# EAGLE design bbot (EAGLE 9.6.2)
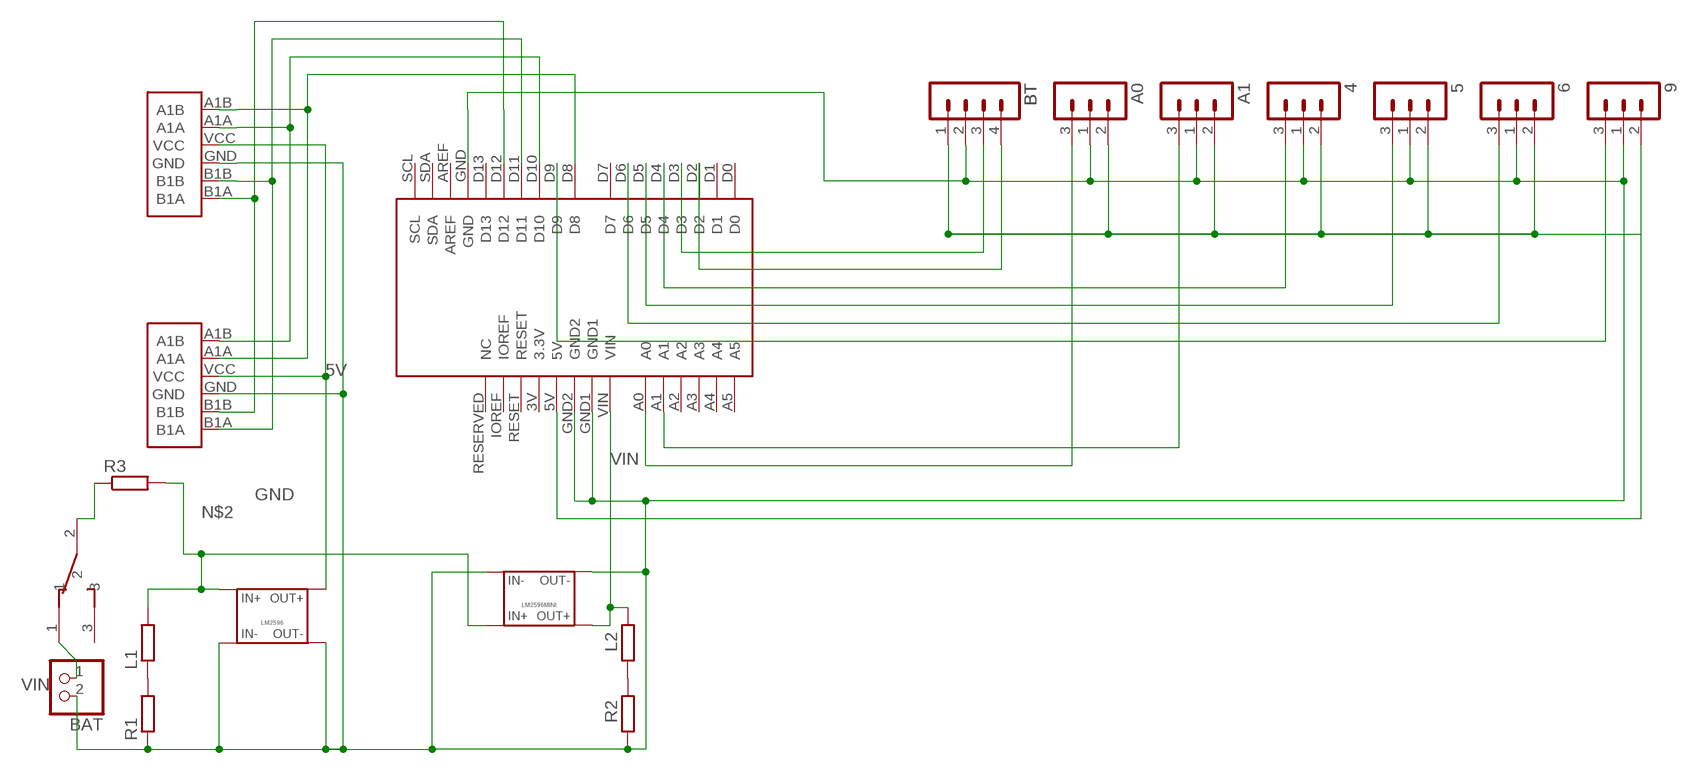
[diagram p0: schematic, sheet 1]

## Parts
4  BB-PIN3  [BB-PIN3]
5  BB-PIN3  [BB-PIN3]
6  BB-PIN3  [BB-PIN3]
9  BB-PIN3  [BB-PIN3]
A0  BB-PIN3  [BB-PIN3]
A1  BB-PIN3  [BB-PIN3]
BAT  VIN  JST_2PIN-THM  [JST-PH-2-THM]
BT  BB-HC06  [BB-HC06]
L1  BB-RESM0805  [M0805]
L2  BB-RESM0805  [M0805]
LM2596  BB-LM2596  [BB-LM2596]
LM2596MINI  BB-LM2596MINI  [BB-LM2596MINI]
R1  BB-RESM0805  [M0805]
R2  BB-RESM0805  [M0805]
R3  R-EU_0207/5V  [0207/5V]
SW1  BB-SWITCHBB-SW  [BB-SWITCH]
U$1  BB-ARD  [BB-ARD]
U$2  BB-PTEH  [BB-PTEH]
U$3  BB-PTEH  [BB-PTEH]

## Nets
5V: LM2596.OUT+ U$2.VCC U$3.VCC
5V-A: 4.2(5V) 5.2(5V) 6.2(5V) 9.2(5V) A0.2(5V) A1.2(5V) BT.1 U$1.5V
7.4V: L1.2 LM2596.IN+ LM2596MINI.IN+ R3.2
GND: 4.1(GND) 5.1(GND) 6.1(GND) 9.1(GND) A0.1(GND) A1.1(GND) BAT.2 BT.2 LM2596.IN- LM2596.OUT- LM2596MINI.IN- LM2596MINI.OUT- R1.1 R2.1 U$1.GND U$1.GND1 U$1.GND2 U$2.GND U$3.GND
N$1: BT.3 U$1.D3
N$2: R3.1 SW1.2
N$4: L1.1 R1.2
N$5: 9.3(S) U$1.D9
N$7: BAT.1 SW1.1
N$8: U$1.D11 U$2.B1B U$3.B1A
N$9: BT.4 U$1.D2
N$11: U$1.D12 U$2.B1A U$3.B1B
N$12: U$1.D10 U$2.A1A U$3.A1B
N$13: U$1.D8 U$2.A1B U$3.A1A
N$14: 6.3(S) U$1.D6
N$15: 5.3(S) U$1.D5
N$16: 4.3(S) U$1.D4
N$17: A1.3(S) U$1.A1
N$18: A0.3(S) U$1.A0
N$19: L2.1 R2.2
VIN: L2.2 LM2596MINI.OUT+ U$1.VIN
Unconnected: SW1.3 U$1.3V(3.3V) U$1.A2 U$1.A3 U$1.A4 U$1.A5 U$1.AREF U$1.D0 U$1.D1 U$1.D7 U$1.D13 U$1.IOREF U$1.RESERVED(NC) U$1.RESET U$1.SCL U$1.SDA

## Library data of the parts
4-6 9 A0 A1 = my-library:BB-PIN3
BAT = adafruit:JST_2PIN: JST 2-Pin Connectors of various flavors SMT-RA (S2B-PH-SM4) 4UConnector #17311 SMT (B2B-PH-SM4) THM-RA (S2B-PH) THM (B2B-PH)
BT = my-library:BB-HC06: PIN HEADER; OC_FARNELL: unknown; OC_NEWARK: unknown
L1 L2 R1 R2 = my-library:BB-RES: RESISTOR, European symbol; SPICEPREFIX: R
LM2596 = my-library:BB-LM2596; SIZE: LM2596
LM2596MINI = my-library:BB-LM2596MINI
R3 = rcl:R-EU_: RESISTOR, European symbol; SPICEPREFIX: R
SW1 = my-library:BB-SWITCH
U$1 = my-library:BB-ARD
U$2 U$3 = my-library:BB-PTEH

## Board
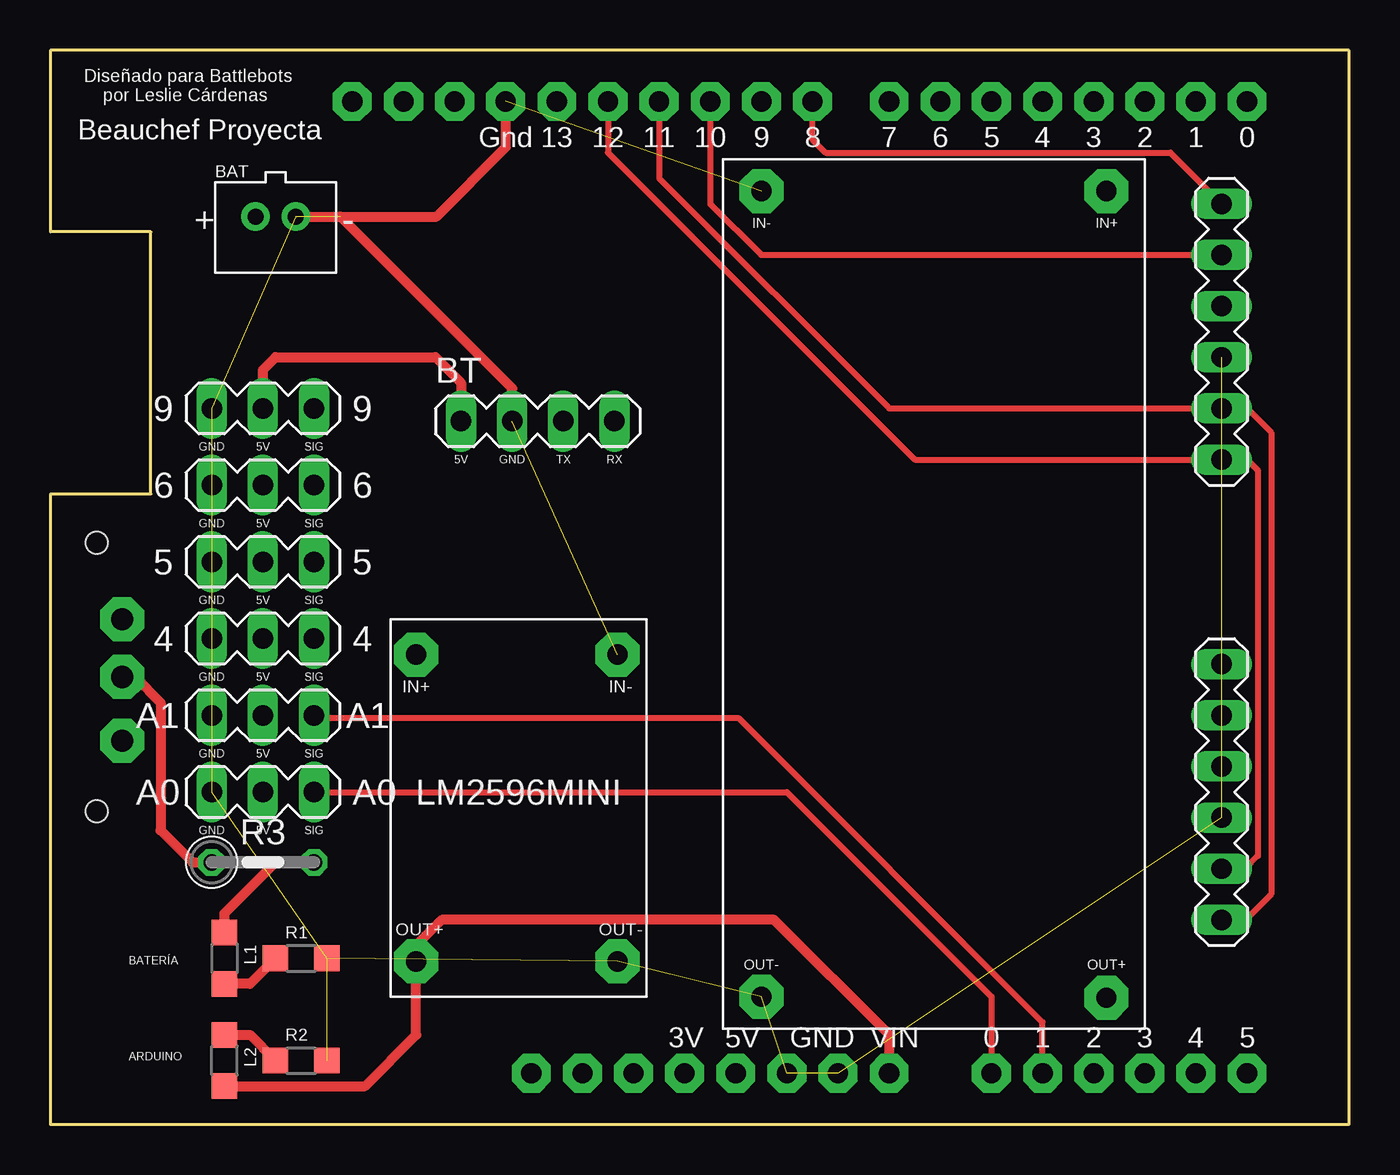
[diagram p1: board, top side]
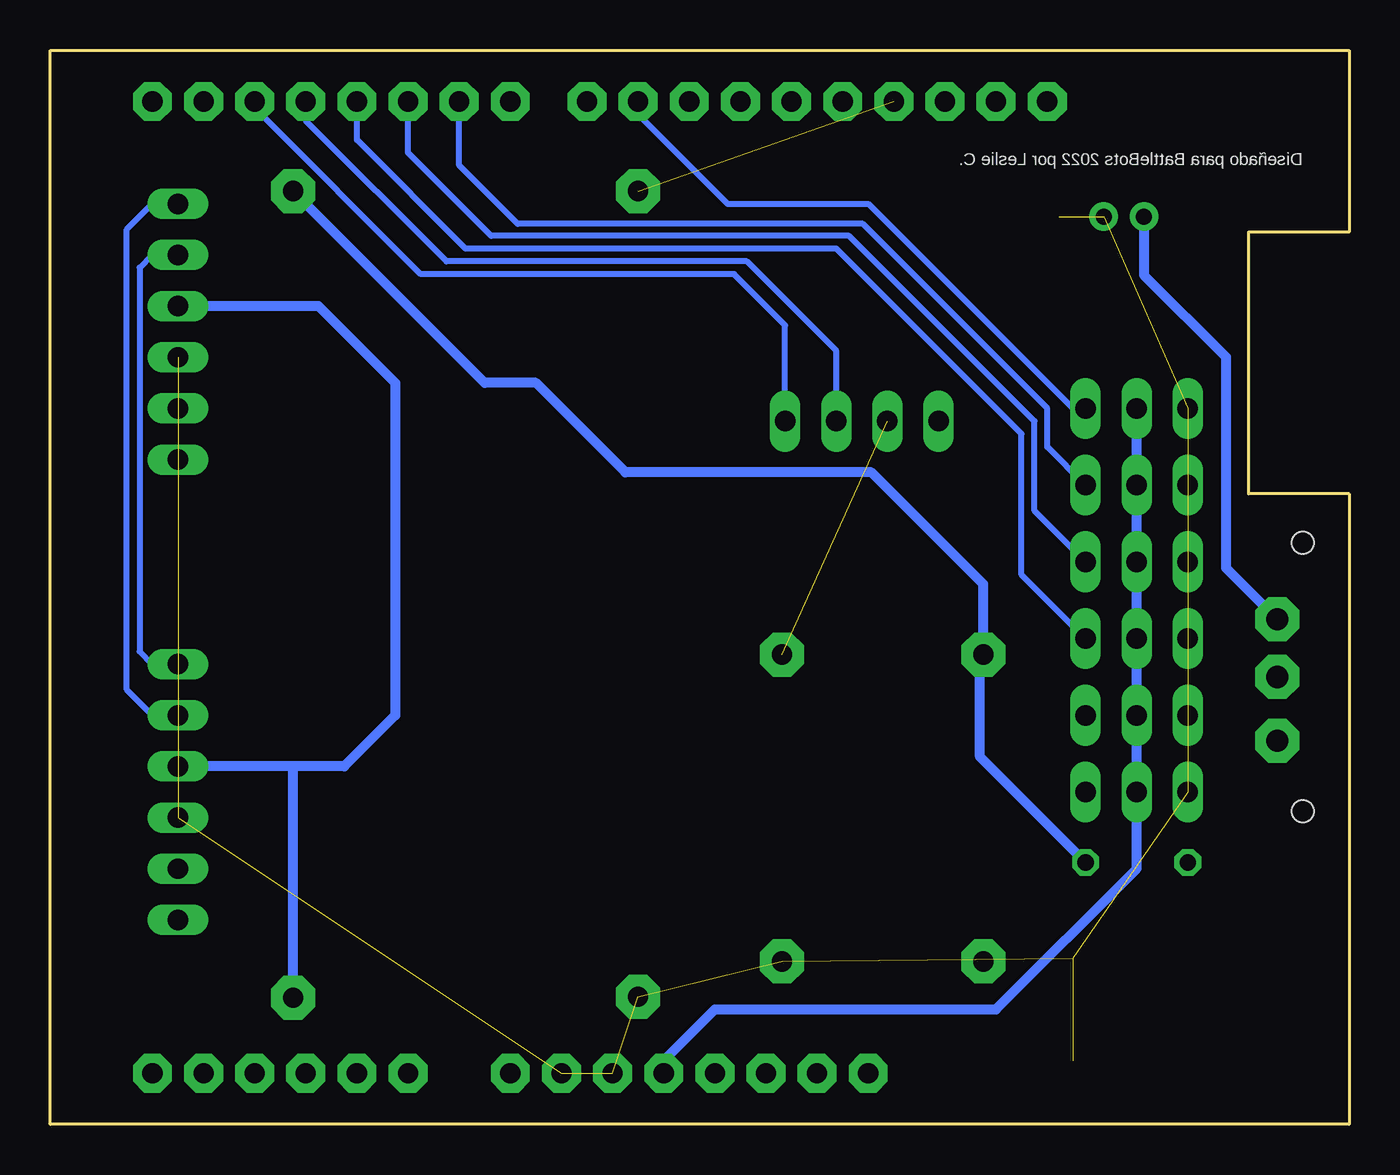
[diagram p2: board, bottom side, seen from below]

Size 64.52 x 53.34 mm. Coordinates in mm from the lower left corner, seen from the top.
Outline: 0,31.32 0,0 64.52,0 64.52,53.34 0,53.34 0,44.32 5,44.32 5,31.32 0,31.32
Copper layers (1*16): Top 0.035mm / dielectric 1.5mm / Bottom 0.035mm
Design rules "default": minimum track width 6mil, minimum drill 0.35mm, track to track 6mil, track to pad 6mil, pad to pad 6mil, via to via 6mil, smd to smd 6mil, copper to edge 40mil, drill to drill 6mil, minimum pad ring 10mil, minimum via ring 8mil, stop-mask expansion 4mil, vias tented up to drill 0mil, thermal gap 10mil

### Footprints (pad centres in the part's own frame; a part is rotated, then mirrored left to right if it is on the bottom)
BB-PIN3 = drill 1.016 long: 1 -2.54,0; 2 0,0; 3 2.54,0
JST-PH-2-THM = drill 0.8 pad 1.422: 1 1,0; 2 -1,0
BB-HC06 = drill 1.016 long: 1 -3.81,0; 2 -1.27,0; 3 1.27,0; 4 3.81,0
M0805 = smd 1.27 x 1.27: 1 -1.27,0; 2 1.27,0
BB-LM2596 = drill 1 pad 2.184 octagon: IN+ 1.905,1.587; IN- 19.05,1.587; OUT+ 1.905,41.643; OUT- 19.05,41.593
BB-LM2596MINI = drill 1 pad 2.184 octagon: IN+ 1.27,16.986; IN- 11.271,16.986; OUT+ 1.27,1.746; OUT- 11.271,1.746
0207/5V = drill 0.813 octagon: 1 -2.54,0; 2 2.54,0
BB-SWITCH = drill 1.1 pad 2.184 octagon: 1 -2.857,0; 2 0,0; 3 3.175,0 | hole 1.1: -6.668,-1.27; 6.668,-1.27
BB-ARD = drill 1 pad 1.93 octagon: 3V 35.56,2.54; 5V 38.1,2.54; A0 50.8,2.54; A1 53.34,2.54; A2 55.88,2.54; A3 58.42,2.54; A4 60.96,2.54; A5 63.5,2.54; AREF 24.13,50.8; D0 63.5,50.8; D1 60.96,50.8; D2 58.42,50.8; D3 55.88,50.8; D4 53.34,50.8; D5 50.8,50.8; D6 48.26,50.8; D7 45.72,50.8; D8 41.91,50.8; D9 39.37,50.8; D10 36.83,50.8; D11 34.29,50.8; D12 31.75,50.8; D13 29.21,50.8; GND 26.67,50.8; GND1 43.18,2.54; GND2 40.64,2.54; IOREF 30.48,2.54; RESERVED 27.94,2.54; RESET 33.02,2.54; SCL 19.05,50.8; SDA 21.59,50.8; VIN 45.72,2.54
BB-PTEH = drill 1.016 long: A1A 3.81,0; A1B 6.35,0; B1A -6.35,0; B1B -3.81,0; GND -1.27,0; VCC 1.27,0

### Placement (x,y rotation side)
4  10.56,24.13 0 top
5  10.56,27.94 0 top
6  10.56,31.75 0 top
9  10.56,35.56 0 top
A0  10.56,16.51 0 top
A1  10.56,20.32 0 top
BAT  11.19,45.09 180 top
BT  24.21,34.93 0 top
L1  8.65,8.26 90 top
L2  8.65,3.18 270 top
LM2596  54.37,47.94 180 top
LM2596MINI  16.91,6.35 0 top
R1  12.46,8.26 180 top
R2  12.46,3.18 180 top
R3  10.56,13.02 0 top
SW1  3.57,22.23 270 top
U$1  -4.05,0 0 top
U$2  58.18,39.37 90 top
U$3  58.18,16.51 90 top

### Tracks (layer width: path | path; a pad name or v marks a point on that pad's centre or on a via)
5V
  Bottom 0.508: U$2.VCC 51.2,40.64 47.39,36.83 47.39,20.32 49.93,17.78 52.47,17.78 | 52.47,17.78 U$3.VCC | LM2596.OUT+ 52.47,17.78
5V-A
  Top 0.508: BT.1 20.4,36.83 19.13,38.1 11.19,38.1 10.56,37.47 9.2
  Bottom 0.508: 9.2 6.2 5.2 4.2 A1.2 A0.2 10.56,12.7 17.54,5.72 31.51,5.72 34.05,3.18 U$1.5V
7.4V
  Top 0.508: L1.2 8.65,10.48 11.19,13.02 R3.2
  Bottom 0.508: R3.2 18.34,18.26 18.34,23.18 LM2596MINI.IN+ 18.18,26.83 23.73,32.39 35.96,32.39 40.4,36.83 42.94,36.83 LM2596.IN+
GND  (17 unrouted)
  Top 0.508: BT.2 22.94,36.56 14.41,45.09 | U$1.GND 22.62,48.53 19.18,45.09 BAT.2
N$1
  Bottom 0.305: BT.3 25.48,38.42 29.92,42.86 44.85,42.86 51.83,49.85 U$1.D3
N$2
  Top 0.508: SW1.2 4.21,22.23 5.48,20.96 5.48,14.61 7.06,13.02 R3.1
N$4
  Top 0.508: R1.2 9.92,6.99 L1.1
N$5
  Bottom 0.305: U$1.D9 35.32,50.17 30.88,45.72 23.89,45.72 13.73,35.56 9.3
N$7
  Bottom 0.508: SW1.1 6.11,27.62 6.11,38.1 10.19,42.18 BAT.1
N$8
  Top 0.305: U$3.B1A 59.38,10.16 60.65,11.43 60.65,34.37 59.45,35.56 U$2.B1B 41.67,35.56 30.24,46.99 U$1.D11
N$9
  Bottom 0.305: BT.4 28.02,39.69 30.56,42.23 46.12,42.23 54.37,50.48 U$1.D2
N$11
  Top 0.305: U$3.B1B 59.35,12.7 59.98,13.34 59.98,32.49 59.45,33.02 U$2.B1A 42.94,33.02 27.7,48.26 U$1.D12
N$12
  Top 0.305: U$1.D10 32.78,45.72 35.32,43.18 U$2.A1A
  Bottom 0.305: U$3.A1B 59.45,22.86 60.09,23.5 60.09,42.55 59.45,43.18 U$2.A1A
N$13
  Top 0.305: U$2.A1B 55.64,48.26 38.5,48.26 37.86,48.9 U$1.D8
  Bottom 0.305: U$3.A1A 59.45,20.32 60.72,21.59 60.72,44.45 59.45,45.72 U$2.A1B
N$14
  Bottom 0.305: 6.3 15,33.66 15,35.56 24.16,44.72 41.3,44.72 44.21,47.62 U$1.D6
N$15
  Bottom 0.305: 5.3 15.64,30.48 15.64,34.93 24.84,44.13 42.62,44.13 46.75,48.26 U$1.D5
N$16
  Bottom 0.305: 4.3 16.27,27.31 16.27,34.29 25.48,43.5 43.89,43.5 49.29,48.9 U$1.D4
N$17
  Top 0.305: A1.3 13.26,20.16 34.21,20.16 49.29,5.08 U$1.A1
N$18
  Top 0.305: A0.3 36.59,16.51 46.75,6.35 U$1.A0
N$19
  Top 0.508: L2.1 9.92,4.45 R2.2
VIN
  Top 0.508: L2.2 15.64,1.91 18.18,4.45 LM2596MINI.OUT+ 18.18,8.89 19.45,10.16 35.96,10.16 41.67,4.45 U$1.VIN

### Text on the board
tPlace: Diseñado para Battlebots | por Leslie Cárdenas | Beauchef Proyecta | BATERÍA | ARDUINO
bNames: Diseñado para BattleBots 2022 por Leslie C.